# EAGLE design Base Board (EAGLE 7.2.0)
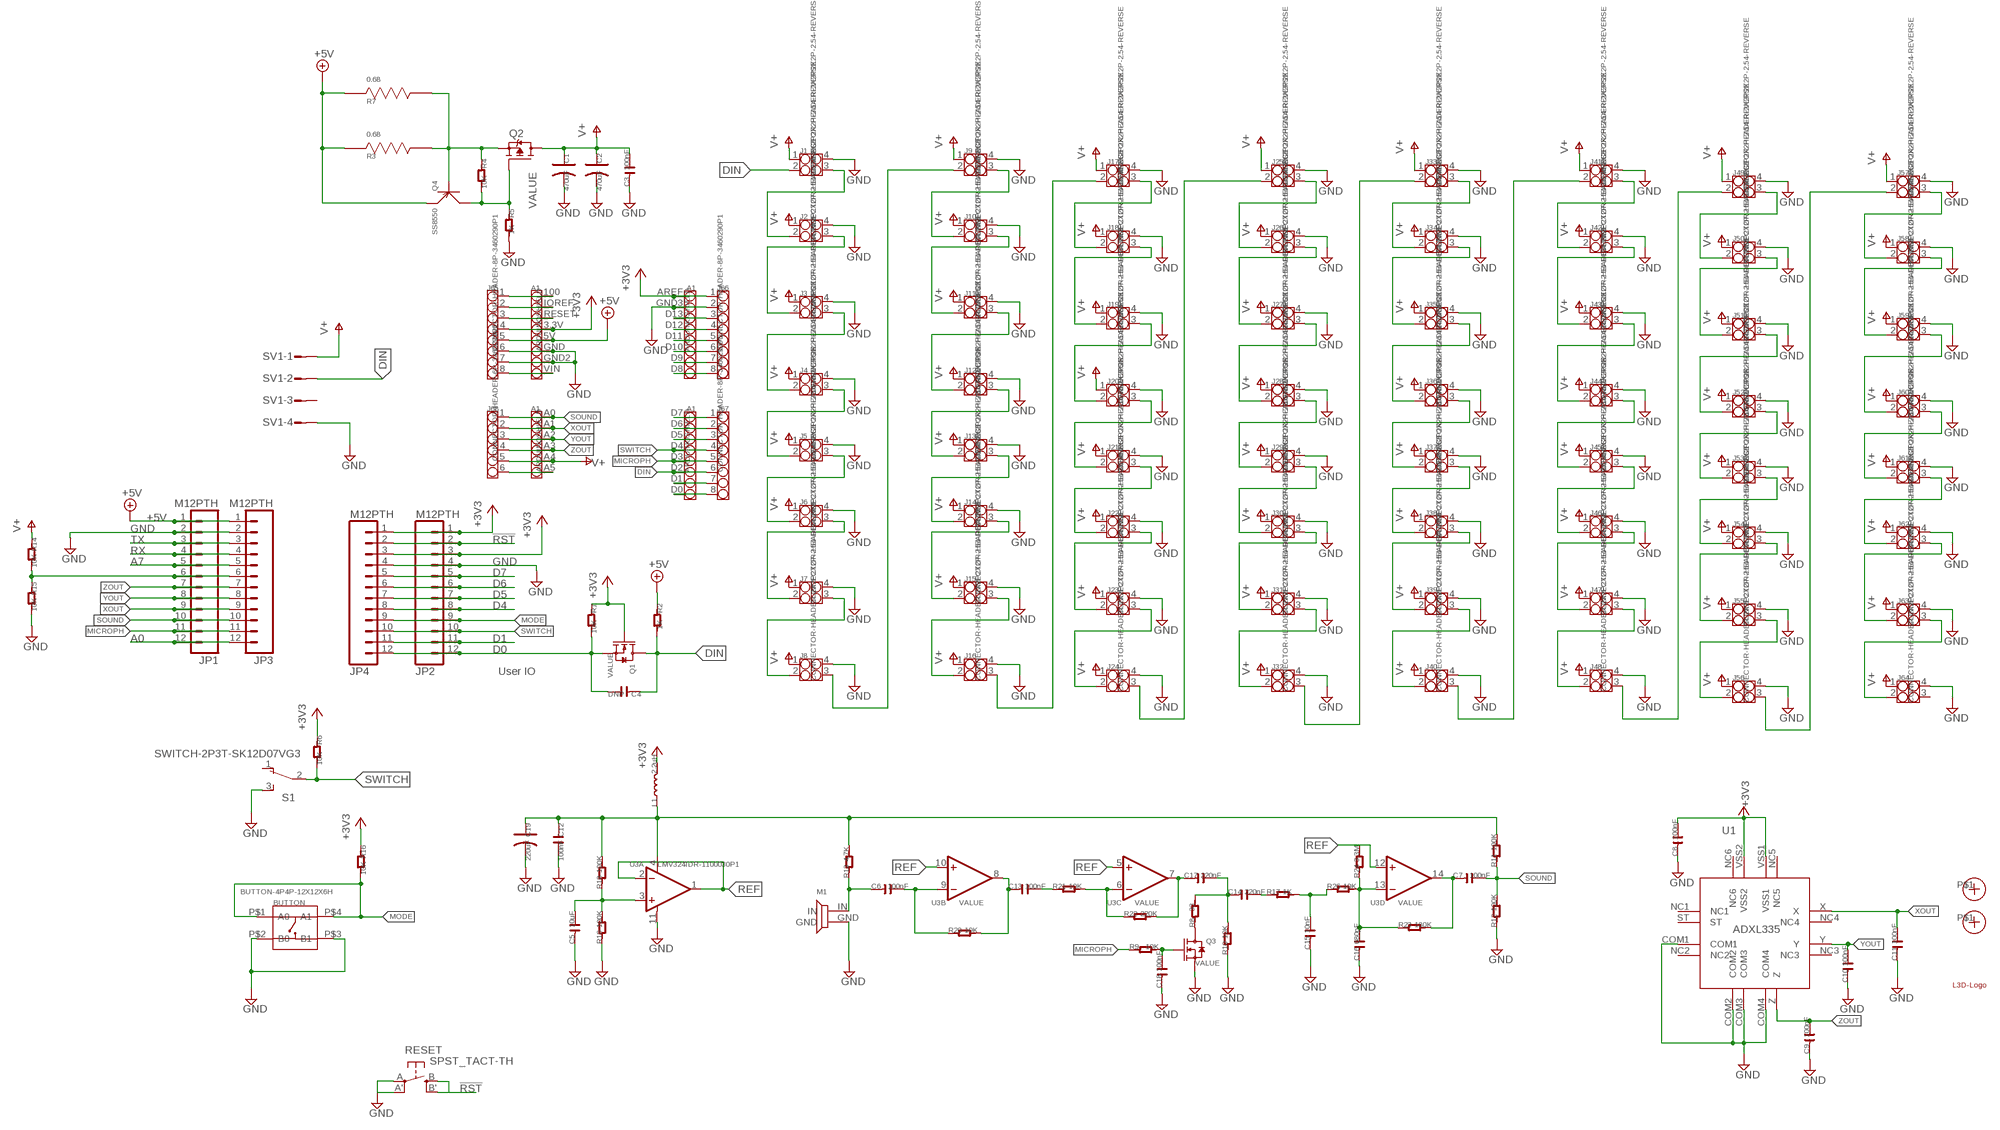
[diagram p0: schematic, sheet 1]

## Parts
A1  ARDUINOSHIELD  [ARDUINOSHIELD]
BUTTON  BUTTON-4P4P-12X12X6H  [4P-12X12X6H]
C1  470uF  C-POLAR  [CAPACITOR-E3-8]
C2  470uF  C-POLAR  [CAPACITOR-E3-8]
C3  100nF  C-0603  [C0603]
C4  DNP  C-0603  [C0603]
C5  10uF  C-0603  [C0603]
C6  100nF  C-0603  [C0603]
C7  100nF  C-0603  [C0603]
C8  100nF  C-0603  [C0603]
C9  100nF  C-0603  [C0603]
C10  100nF  C-0603  [C0603]
C11  100nF  C-0603  [C0603]
C12  100nF  C-0603  [C0603]
C13  100nF  C-0603  [C0603]
C14  220nF  C-0603  [C0603]
C15  10nF  C-0603  [C0603]
C16  680pF  C-0603  [C0603]
C17  220nF  C-0603  [C0603]
C18  100nF  C-0603  [C0603]
C19  220uF  C-POLAR-B  [AVX-B]
J1  CONNECTOR-HEADER-2X2P2X2P-2.54-REVERSE  [2X2P-2.54-REVERSE]
J2  CONNECTOR-HEADER-2X2P2X2P-2.54-REVERSE  [2X2P-2.54-REVERSE]
J3  CONNECTOR-HEADER-2X2P2X2P-2.54-REVERSE  [2X2P-2.54-REVERSE]
J4  CONNECTOR-HEADER-2X2P2X2P-2.54-REVERSE  [2X2P-2.54-REVERSE]
J5  CONNECTOR-HEADER-2X2P2X2P-2.54-REVERSE  [2X2P-2.54-REVERSE]
J6  CONNECTOR-HEADER-2X2P2X2P-2.54-REVERSE  [2X2P-2.54-REVERSE]
J7  CONNECTOR-HEADER-2X2P2X2P-2.54-REVERSE  [2X2P-2.54-REVERSE]
J8  CONNECTOR-HEADER-2X2P2X2P-2.54-REVERSE  [2X2P-2.54-REVERSE]
J9  CONNECTOR-HEADER-2X2P2X2P-2.54-REVERSE  [2X2P-2.54-REVERSE]
J10  CONNECTOR-HEADER-2X2P2X2P-2.54-REVERSE  [2X2P-2.54-REVERSE]
J11  CONNECTOR-HEADER-2X2P2X2P-2.54-REVERSE  [2X2P-2.54-REVERSE]
J12  CONNECTOR-HEADER-2X2P2X2P-2.54-REVERSE  [2X2P-2.54-REVERSE]
J13  CONNECTOR-HEADER-2X2P2X2P-2.54-REVERSE  [2X2P-2.54-REVERSE]
J14  CONNECTOR-HEADER-2X2P2X2P-2.54-REVERSE  [2X2P-2.54-REVERSE]
J15  CONNECTOR-HEADER-2X2P2X2P-2.54-REVERSE  [2X2P-2.54-REVERSE]
J16  CONNECTOR-HEADER-2X2P2X2P-2.54-REVERSE  [2X2P-2.54-REVERSE]
J17  CONNECTOR-HEADER-2X2P2X2P-2.54-REVERSE  [2X2P-2.54-REVERSE]
J18  CONNECTOR-HEADER-2X2P2X2P-2.54-REVERSE  [2X2P-2.54-REVERSE]
J19  CONNECTOR-HEADER-2X2P2X2P-2.54-REVERSE  [2X2P-2.54-REVERSE]
J20  CONNECTOR-HEADER-2X2P2X2P-2.54-REVERSE  [2X2P-2.54-REVERSE]
J21  CONNECTOR-HEADER-2X2P2X2P-2.54-REVERSE  [2X2P-2.54-REVERSE]
J22  CONNECTOR-HEADER-2X2P2X2P-2.54-REVERSE  [2X2P-2.54-REVERSE]
J23  CONNECTOR-HEADER-2X2P2X2P-2.54-REVERSE  [2X2P-2.54-REVERSE]
J24  CONNECTOR-HEADER-2X2P2X2P-2.54-REVERSE  [2X2P-2.54-REVERSE]
J25  CONNECTOR-HEADER-2X2P2X2P-2.54-REVERSE  [2X2P-2.54-REVERSE]
J26  CONNECTOR-HEADER-2X2P2X2P-2.54-REVERSE  [2X2P-2.54-REVERSE]
J27  CONNECTOR-HEADER-2X2P2X2P-2.54-REVERSE  [2X2P-2.54-REVERSE]
J28  CONNECTOR-HEADER-2X2P2X2P-2.54-REVERSE  [2X2P-2.54-REVERSE]
J29  CONNECTOR-HEADER-2X2P2X2P-2.54-REVERSE  [2X2P-2.54-REVERSE]
J30  CONNECTOR-HEADER-2X2P2X2P-2.54-REVERSE  [2X2P-2.54-REVERSE]
J31  CONNECTOR-HEADER-2X2P2X2P-2.54-REVERSE  [2X2P-2.54-REVERSE]
J32  CONNECTOR-HEADER-2X2P2X2P-2.54-REVERSE  [2X2P-2.54-REVERSE]
J33  CONNECTOR-HEADER-2X2P2X2P-2.54-REVERSE  [2X2P-2.54-REVERSE]
J34  CONNECTOR-HEADER-2X2P2X2P-2.54-REVERSE  [2X2P-2.54-REVERSE]
J35  CONNECTOR-HEADER-2X2P2X2P-2.54-REVERSE  [2X2P-2.54-REVERSE]
J36  CONNECTOR-HEADER-2X2P2X2P-2.54-REVERSE  [2X2P-2.54-REVERSE]
J37  CONNECTOR-HEADER-2X2P2X2P-2.54-REVERSE  [2X2P-2.54-REVERSE]
J38  CONNECTOR-HEADER-2X2P2X2P-2.54-REVERSE  [2X2P-2.54-REVERSE]
J39  CONNECTOR-HEADER-2X2P2X2P-2.54-REVERSE  [2X2P-2.54-REVERSE]
J40  CONNECTOR-HEADER-2X2P2X2P-2.54-REVERSE  [2X2P-2.54-REVERSE]
J41  CONNECTOR-HEADER-2X2P2X2P-2.54-REVERSE  [2X2P-2.54-REVERSE]
J42  CONNECTOR-HEADER-2X2P2X2P-2.54-REVERSE  [2X2P-2.54-REVERSE]
J43  CONNECTOR-HEADER-2X2P2X2P-2.54-REVERSE  [2X2P-2.54-REVERSE]
J44  CONNECTOR-HEADER-2X2P2X2P-2.54-REVERSE  [2X2P-2.54-REVERSE]
J45  CONNECTOR-HEADER-2X2P2X2P-2.54-REVERSE  [2X2P-2.54-REVERSE]
J46  CONNECTOR-HEADER-2X2P2X2P-2.54-REVERSE  [2X2P-2.54-REVERSE]
J47  CONNECTOR-HEADER-2X2P2X2P-2.54-REVERSE  [2X2P-2.54-REVERSE]
J48  CONNECTOR-HEADER-2X2P2X2P-2.54-REVERSE  [2X2P-2.54-REVERSE]
J49  CONNECTOR-HEADER-2X2P2X2P-2.54-REVERSE  [2X2P-2.54-REVERSE]
J50  CONNECTOR-HEADER-2X2P2X2P-2.54-REVERSE  [2X2P-2.54-REVERSE]
J51  CONNECTOR-HEADER-2X2P2X2P-2.54-REVERSE  [2X2P-2.54-REVERSE]
J52  CONNECTOR-HEADER-2X2P2X2P-2.54-REVERSE  [2X2P-2.54-REVERSE]
J53  CONNECTOR-HEADER-2X2P2X2P-2.54-REVERSE  [2X2P-2.54-REVERSE]
J54  CONNECTOR-HEADER-2X2P2X2P-2.54-REVERSE  [2X2P-2.54-REVERSE]
J55  CONNECTOR-HEADER-2X2P2X2P-2.54-REVERSE  [2X2P-2.54-REVERSE]
J56  CONNECTOR-HEADER-2X2P2X2P-2.54-REVERSE  [2X2P-2.54-REVERSE]
J57  CONNECTOR-HEADER-2X2P2X2P-2.54-REVERSE  [2X2P-2.54-REVERSE]
J58  CONNECTOR-HEADER-2X2P2X2P-2.54-REVERSE  [2X2P-2.54-REVERSE]
J59  CONNECTOR-HEADER-2X2P2X2P-2.54-REVERSE  [2X2P-2.54-REVERSE]
J60  CONNECTOR-HEADER-2X2P2X2P-2.54-REVERSE  [2X2P-2.54-REVERSE]
J61  CONNECTOR-HEADER-2X2P2X2P-2.54-REVERSE  [2X2P-2.54-REVERSE]
J62  CONNECTOR-HEADER-2X2P2X2P-2.54-REVERSE  [2X2P-2.54-REVERSE]
J63  CONNECTOR-HEADER-2X2P2X2P-2.54-REVERSE  [2X2P-2.54-REVERSE]
J64  CONNECTOR-HEADER-2X2P2X2P-2.54-REVERSE  [2X2P-2.54-REVERSE]
J65  CONNECTOR-HEADER-8P-3460290P1  [1X8P-2.54-8.5-BLACK-FEMALE]
J66  CONNECTOR-HEADER-8P-3460290P1  [1X8P-2.54-8.5-BLACK-FEMALE]
J67  CONNECTOR-HEADER-8P-3460290P1  [1X8P-2.54-8.5-BLACK-FEMALE]
J68  CONNECTOR-HEADER-6P-3460270P1  [1X6P-2.54-8.5-BLACK-FEMALE]
JP1  M12PTH  [1X12-SMALL-PADS]
JP2  M12PTH  [1X12-SMALL-PADS]
JP3  M12PTH  [1X12-SMALL-PADS]
JP4  M12PTH  [1X12-SMALL-PADS]
L1  2.2uH  L-0603  [L0603]
M1  MICROPHONE  [MICROPHONE]
Q1  2N7002  MOSFET-N-044020001  [SOT23]
Q2  FDD6637  FDD4141TO252  [TO252]
Q3  2N7002  MOSFET-N-044020001  [SOT23]
Q4  SS8550  TRANSISTOR-PNP-041003001  [SOT23]
R1  10K  R-0603  [R0603]
R2  1K  R-0603  [R0603]
R3  0.68  RESISTOR-3W-20MM  [RESISTOR-3W-20MM]
R4  10K  R-0603  [R0603]
R5  1K  R-0603  [R0603]
R6  10K  R-0603  [R0603]
R7  0.68  RESISTOR-3W-20MM  [RESISTOR-3W-20MM]
R8  33  R-0603  [R0603]
R9  10K  R-0603  [R0603]
R10  10K  R-0603  [R0603]
R11  100K  R-0603  [R0603]
R12  100K  R-0603  [R0603]
R13  4.7K  R-0603  [R0603]
R14  10K  R-0603  [R0603]
R15  10K  R-0603  [R0603]
R16  10K  R-0603  [R0603]
R17  1K  R-0603  [R0603]
R18  100K  R-0603  [R0603]
R19  100K  R-0603  [R0603]
R20  10K  R-0603  [R0603]
R21  10K  R-0603  [R0603]
R22  220K  R-0603  [R0603]
R23  180K  R-0603  [R0603]
R24  3.3M  R-0603  [R0603]
R26  10K  R-0603  [R0603]
RESET  SPST_TACT-TH  [EVQ-Q2-TH]
S1  SWITCH-2P3T-SK12D07VG3  [SWITCH-2P3T-SK12D07VG3]
SV1  CON-S04P  [S04P]
U1  ADXL335  [ADXL335]
U3  LMV324IDR-1100030P1  [SOIC14]
U$1  L3D-LOGOL3DCUBE-LOGO-0.8X2.5  [L3DCUBE-LOGO-0.8X2.5]
U$2  FIDUCIAL-MARK  [FIDUCIAL-MARK]
U$3  FIDUCIAL-MARK  [FIDUCIAL-MARK]

## Nets
!RST: JP2.2 JP4.2 RESET.B'(S1) RESET.B(S)
+3V3: A1.3.3V A1.AREF C8.2 J65.4 J66.1 JP2.1 JP2.3 JP4.1 JP4.3 L1.2 Q1.1(G) R1.1 R6.1 R16.1 U1.VSS1 U1.VSS2
+5V: A1.5V J65.5 JP1.1 JP3.1 Q4.2(E) R2.1 R3.1 R7.1
A0: JP1.12 JP3.12
A7: JP1.5 JP3.5
D0: C4.2 JP2.12 JP4.12 Q1.2(S) R1.2
D1: JP2.11 JP4.11
D4: JP2.8 JP4.8
D5: JP2.7 JP4.7
D6: JP2.6 JP4.6
D7: JP2.5 JP4.5
DIN: A1.D2 C4.1 J1.2 J67.6 Q1.3(D) R2.2 SV1.2 SV1.P$2
GND [vcc]: A1.GND A1.GND2 A1.GND3 BUTTON.P$2(B0) BUTTON.P$3(B1) C1.- C2.- C3.1 C5.1 C8.1 C9.1 C10.1 C11.1 C12.2 C15.1 C16.1 C18.1 C19.- J1.4 J2.4 J3.4 J4.4 J5.4 J6.4 J7.4 J8.4 J9.4 J10.4 J11.4 J12.4 J13.4 J14.4 J15.4 J16.4 J17.4 J18.4 J19.4 J20.4 J21.4 J22.4 J23.4 J24.4 J25.4 J26.4 J27.4 J28.4 J29.4 J30.4 J31.4 J32.4 J33.4 J34.4 J35.4 J36.4 J37.4 J38.4 J39.4 J40.4 J41.4 J42.4 J43.4 J44.4 J45.4 J46.4 J47.4 J48.4 J49.4 J50.4 J51.4 J52.4 J53.4 J54.4 J55.4 J56.4 J57.4 J58.4 J59.4 J60.4 J61.4 J62.4 J63.4 J64.4 J65.6 J65.7 J66.2 JP1.2 JP2.4 JP3.2 JP4.4 M1.GND Q3.2(S) R5.2 R10.1 R12.1 R15.2 R19.1 RESET.A'(P1) RESET.A(P) S1.3(S) SV1.4 SV1.P$4 U1.COM1 U1.COM2 U1.COM3 U1.COM4 U3.11(A:V-)
MICROPH: A1.D3 J67.5 JP1.11 JP3.11 R9.1
MODE: BUTTON.P$1(A0) BUTTON.P$4(A1) JP2.9 JP4.9 R16.2
N$1: J1.3 J2.2
N$2: J2.3 J3.2
N$3: J3.3 J4.2
N$4: J5.3 J6.2
N$5: J6.3 J7.2
N$6: J7.3 J8.2
N$7: J4.3 J5.2
N$8: J9.3 J10.2
N$9: J10.3 J11.2
N$10: J11.3 J12.2
N$11: J13.3 J14.2
N$12: J14.3 J15.2
N$13: J15.3 J16.2
N$14: J12.3 J13.2
N$15: J17.3 J18.2
N$16: J18.3 J19.2
N$17: J19.3 J20.2
N$18: J21.3 J22.2
N$19: J22.3 J23.2
N$20: J23.3 J24.2
N$21: J20.3 J21.2
N$22: J25.3 J26.2
N$23: J26.3 J27.2
N$24: J27.3 J28.2
N$25: J29.3 J30.2
N$26: J30.3 J31.2
N$27: J31.3 J32.2
N$28: J28.3 J29.2
N$29: J8.3 J9.2
N$30: J16.3 J17.2
N$31: J24.3 J25.2
N$32: C18.2 Q3.1(G) R9.2
N$33: J33.3 J34.2
N$34: J34.3 J35.2
N$35: J35.3 J36.2
N$36: J37.3 J38.2
N$37: J38.3 J39.2
N$38: J39.3 J40.2
N$39: J36.3 J37.2
N$40: J41.3 J42.2
N$41: J42.3 J43.2
N$42: J43.3 J44.2
N$43: J45.3 J46.2
N$44: J46.3 J47.2
N$45: J47.3 J48.2
N$46: J44.3 J45.2
N$47: J49.3 J50.2
N$48: J50.3 J51.2
N$49: J51.3 J52.2
N$50: J53.3 J54.2
N$51: J54.3 J55.2
N$52: J55.3 J56.2
N$53: J52.3 J53.2
N$54: J57.3 J58.2
N$55: J58.3 J59.2
N$56: J59.3 J60.2
N$57: J61.3 J62.2
N$58: J62.3 J63.2
N$59: J63.3 J64.2
N$60: J60.3 J61.2
N$61: J40.3 J41.2
N$62: J48.3 J49.2
N$63: J56.3 J57.2
N$64: J32.3 J33.2
N$65: Q2.2(S) Q4.1(B) R3.2 R4.1 R7.2
N$66: Q3.3(D) R8.1
N$67: Q2.1(G) Q4.3(C) R4.2 R5.1
N$68: C14.2 R17.1
N$69: C15.2 R17.2 R26.1
N$70: C16.2 R23.1 R24.1 R26.2 U3.13(D:IN-)
N$71: JP1.6 JP3.6 R14.2 R15.1
N$72: C6.1 M1.IN R13.1
N$73: A1.100 J65.1
N$74: A1.IOREF J65.2
N$82: A1.RESET J65.3
N$83: A1.VIN J65.8
N$84: A1.A5 J68.6
N$85: A1.D13 J66.3
N$86: A1.D12 J66.4
N$87: A1.D11 J66.5
N$88: A1.D10 J66.6
N$89: A1.D9 J66.7
N$90: A1.D8 J66.8
N$91: A1.D7 J67.1
N$92: A1.D6 J67.2
N$93: A1.D5 J67.3
N$94: A1.D1 J67.7
N$95: A1.D0 J67.8
N$96: C5.2 R18.1 R19.2 U3.3(A:IN+)
N$97: C6.2 R20.1 U3.9(B:IN-)
N$98: C13.1 R20.2 U3.8(B:OUT)
N$99: C13.2 R21.1
N$100: R21.2 R22.1 U3.6(C:IN-)
N$101: C14.1 C17.2 R8.2 R10.2
N$102: C12.1 C19.+ L1.1 R11.2 R13.2 R18.2 U3.4(A:V+)
N$104: C7.1 R23.2 U3.14(D:OUT)
N$106: C17.1 R22.2 U3.7(C:OUT)
REF: R24.2 U3.1(A:OUT) U3.2(A:IN-) U3.5(C:IN+) U3.10(B:IN+) U3.12(D:IN+)
RX: JP1.4 JP3.4
SOUND: A1.A0 C7.2 J68.1 JP1.10 JP3.10 R11.1 R12.2
SWITCH: A1.D4 J67.4 JP2.10 JP4.10 R6.2 S1.2(P)
TX: JP1.3 JP3.3
V+: A1.A4 C1.+ C2.+ C3.2 J1.1 J2.1 J3.1 J4.1 J5.1 J6.1 J7.1 J8.1 J9.1 J10.1 J11.1 J12.1 J13.1 J14.1 J15.1 J16.1 J17.1 J18.1 J19.1 J20.1 J21.1 J22.1 J23.1 J24.1 J25.1 J26.1 J27.1 J28.1 J29.1 J30.1 J31.1 J32.1 J33.1 J34.1 J35.1 J36.1 J37.1 J38.1 J39.1 J40.1 J41.1 J42.1 J43.1 J44.1 J45.1 J46.1 J47.1 J48.1 J49.1 J50.1 J51.1 J52.1 J53.1 J54.1 J55.1 J56.1 J57.1 J58.1 J59.1 J60.1 J61.1 J62.1 J63.1 J64.1 J68.5 Q2.3(D) R14.1 SV1.1 SV1.P$1
XOUT: A1.A1 C11.2 J68.2 JP1.9 JP3.9 U1.X
YOUT: A1.A2 C10.2 J68.3 JP1.8 JP3.8 U1.Y
ZOUT: A1.A3 C9.2 J68.4 JP1.7 JP3.7 U1.Z
Unconnected: J64.3 S1.1(O) SV1.3 SV1.P$3 U1.NC1 U1.NC2 U1.NC3 U1.NC4 U1.NC5 U1.NC6 U1.ST U$2.P$1 U$3.P$1

## Notes on the sheet
- User IO

## Library data of the parts
A1 = OPL Eagle Library:ARDUINOSHIELD
BUTTON = OPL Eagle Library:BUTTON-4P
C1 C2 C19 = OPL Eagle Library:C-POLAR*
C3-C18 = OPL Eagle Library:C*
J1-J64 = OPL Eagle Library:CONNECTOR-HEADER-2X2P
J65-J67 = OPL Eagle Library:CONNECTOR-HEADER-8P
J68 = OPL Eagle Library:CONNECTOR-HEADER-6P
JP1-JP4 = Spark:M12: Header 12 Standard 12-pin 0.1" header. Use with straight break away headers (SKU : PRT-00116), right angle break away headers (PRT-00553), swiss pins (PRT-00743), machine pins (PRT-00117), and female headers (PRT-00115).
L1 = OPL Eagle Library:L*
M1 = OPL Eagle Library:MICROPHONE
Q1 Q3 = OPL Eagle Library:MOSFET-N: CJ2302：SMD MOSFET N-CH 20V-2.1A
Q2 = transistor-fet:FDD4141: P-Channel PowerTrench® MOSFET Source: FDD4141.pdf
Q4 = OPL Eagle Library:TRANSISTOR-PNP*: S8550：PNP Transistor
R1 R2 R4-R6 R8-R24 R26 = OPL Eagle Library:R*
R3 R7 = OPL Eagle Library:RESISTOR-3W-20MM
RESET = adafruit:SPST_TACT: SMT 6mm switch, EVQQ2 series http://www.ladyada.net/library/eagle
S1 = OPL Eagle Library:SWITCH-2P3T-SK12D07VG3: TINY SWITCH ON - ON Source: http://www2.produktinfo.conrad.com/datenblaetter/700000-724999/705152-da-01-de-Subminiaturschalter_TL_36YO.pdf
SV1 = OPL Eagle Library:CON-S04P: AMP MT CONNECTOR; OC_FARNELL: unknown; OC_NEWARK: unknown
U1 = OPL Eagle Library:ADXL335
U3 = OPL Eagle Library:LMV324IDR: General purpose LOW Voltage, Rail-to-Rail Output Amplifiers http://www.fairchildsemi.com/ds/LM/LMV358.pdf
U$1 = OPL Eagle Library:L3D-LOGO
U$2 U$3 = OPL Eagle Library:FIDUCIAL-MARK

## Board
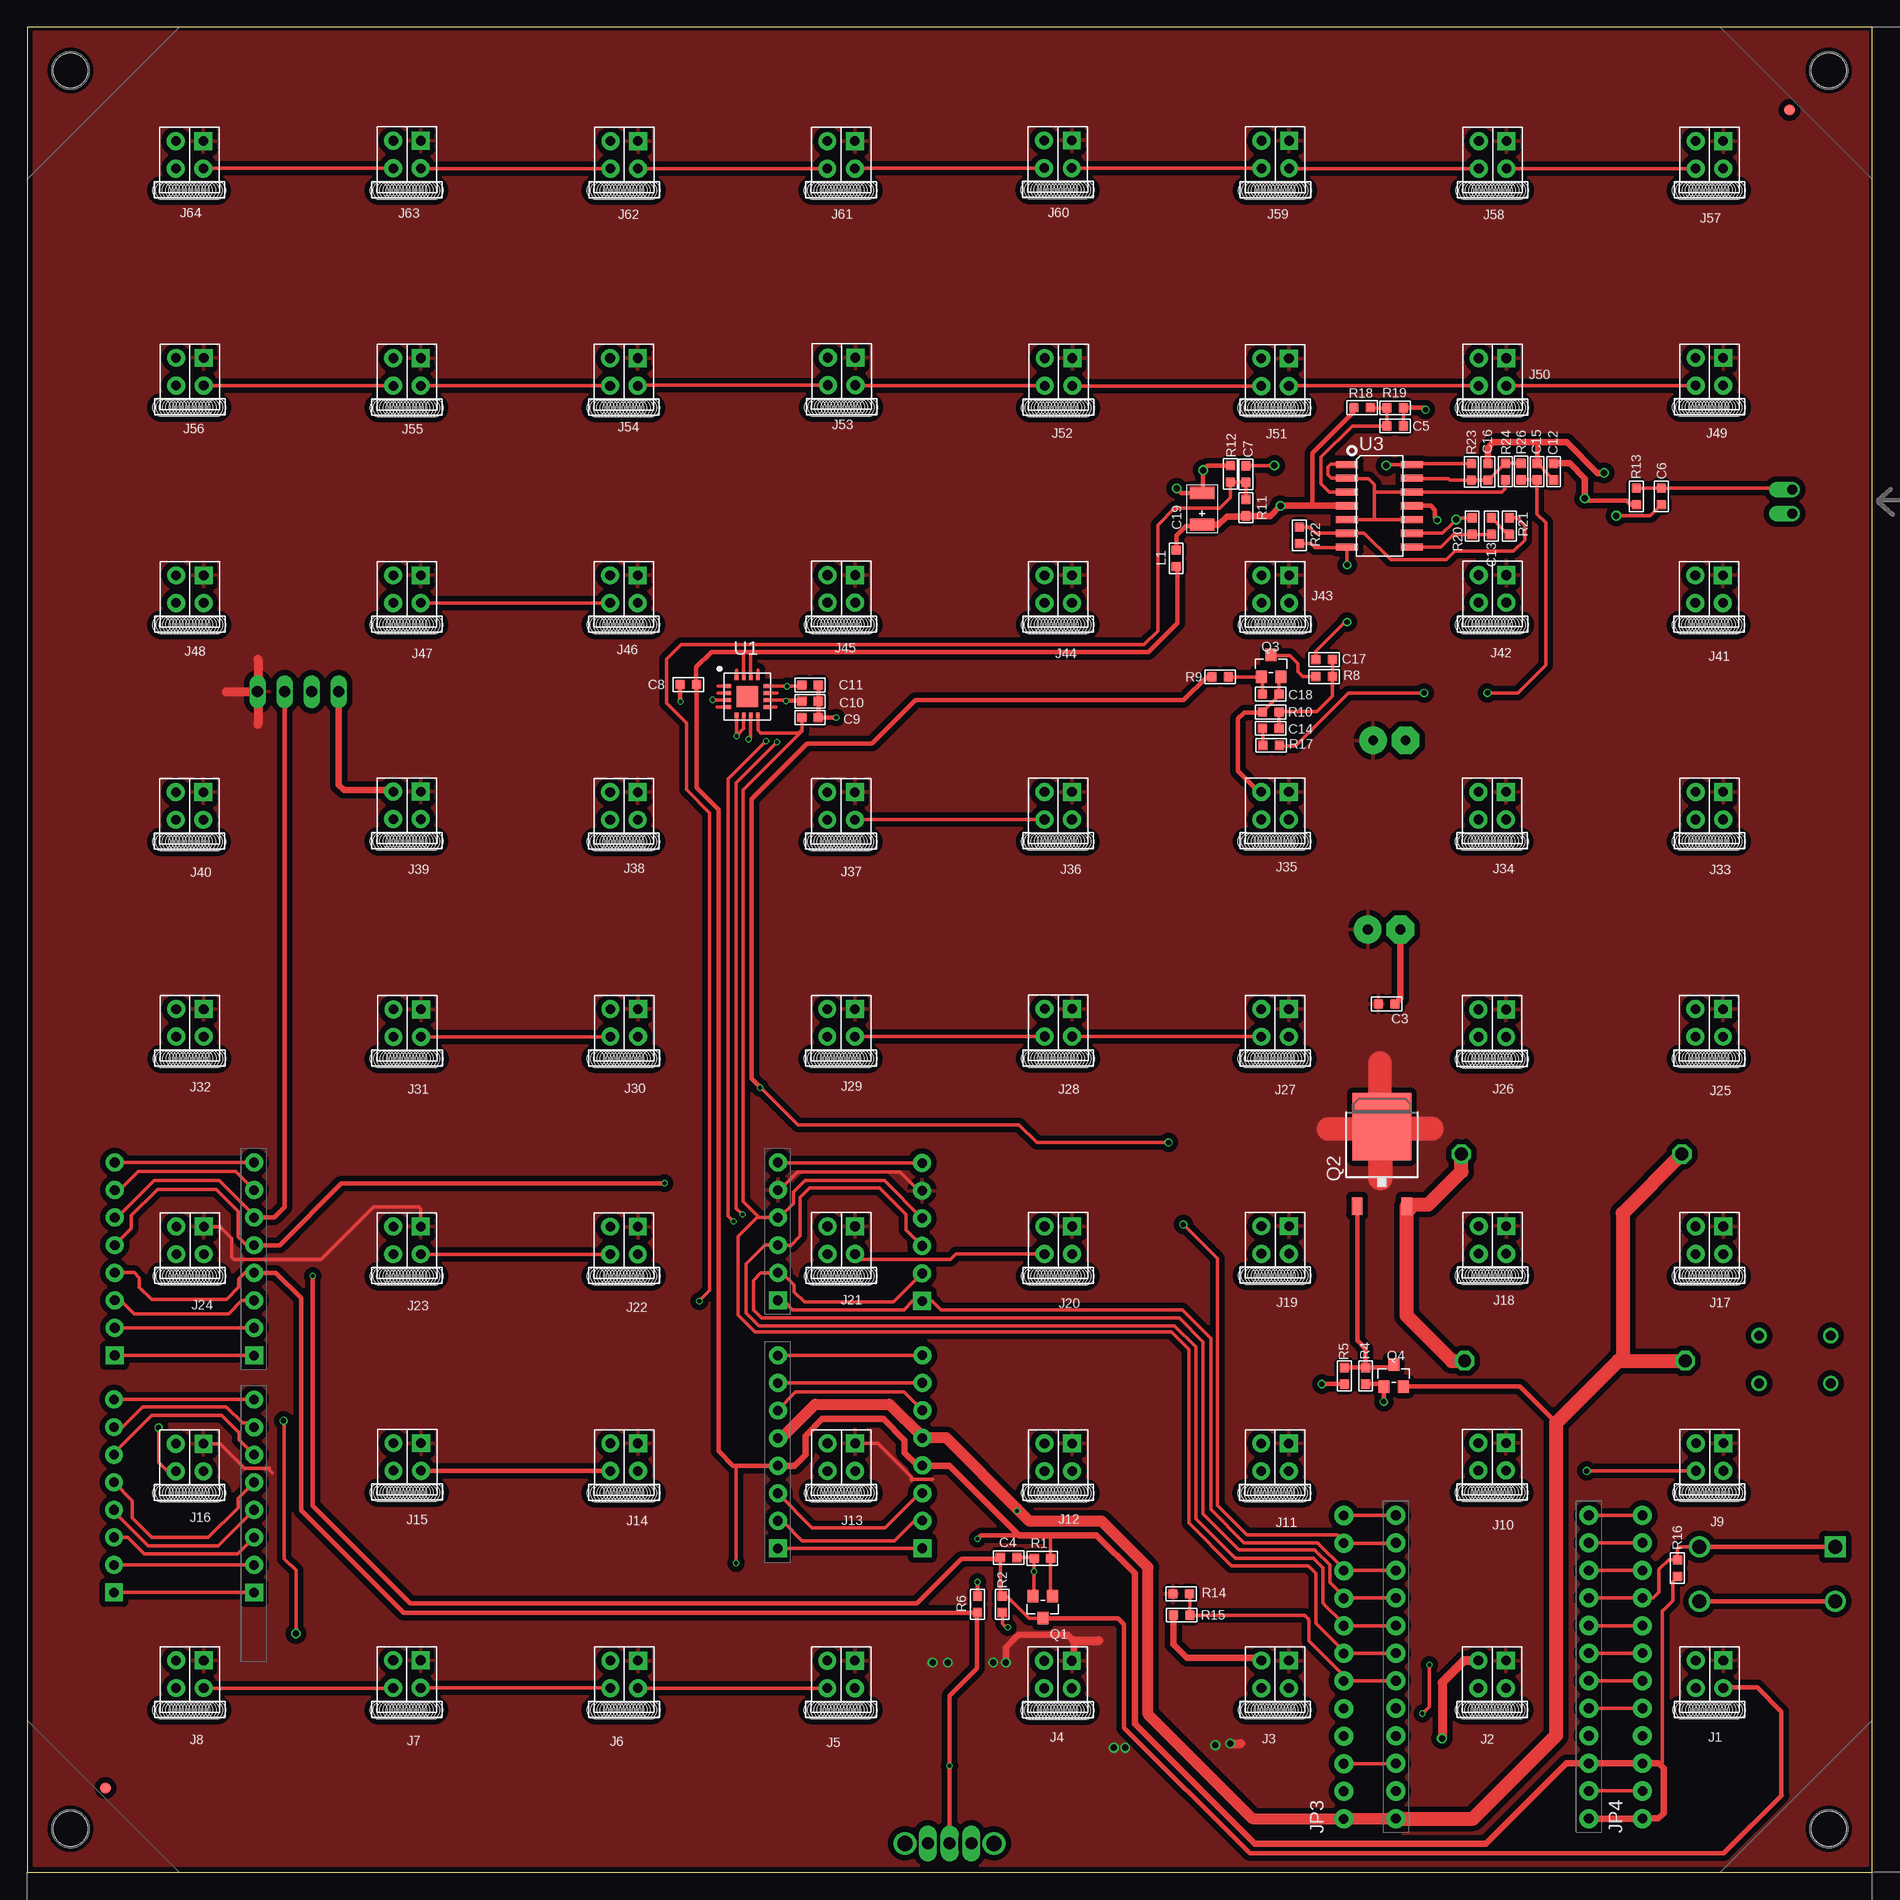
[diagram p1: board, top side]
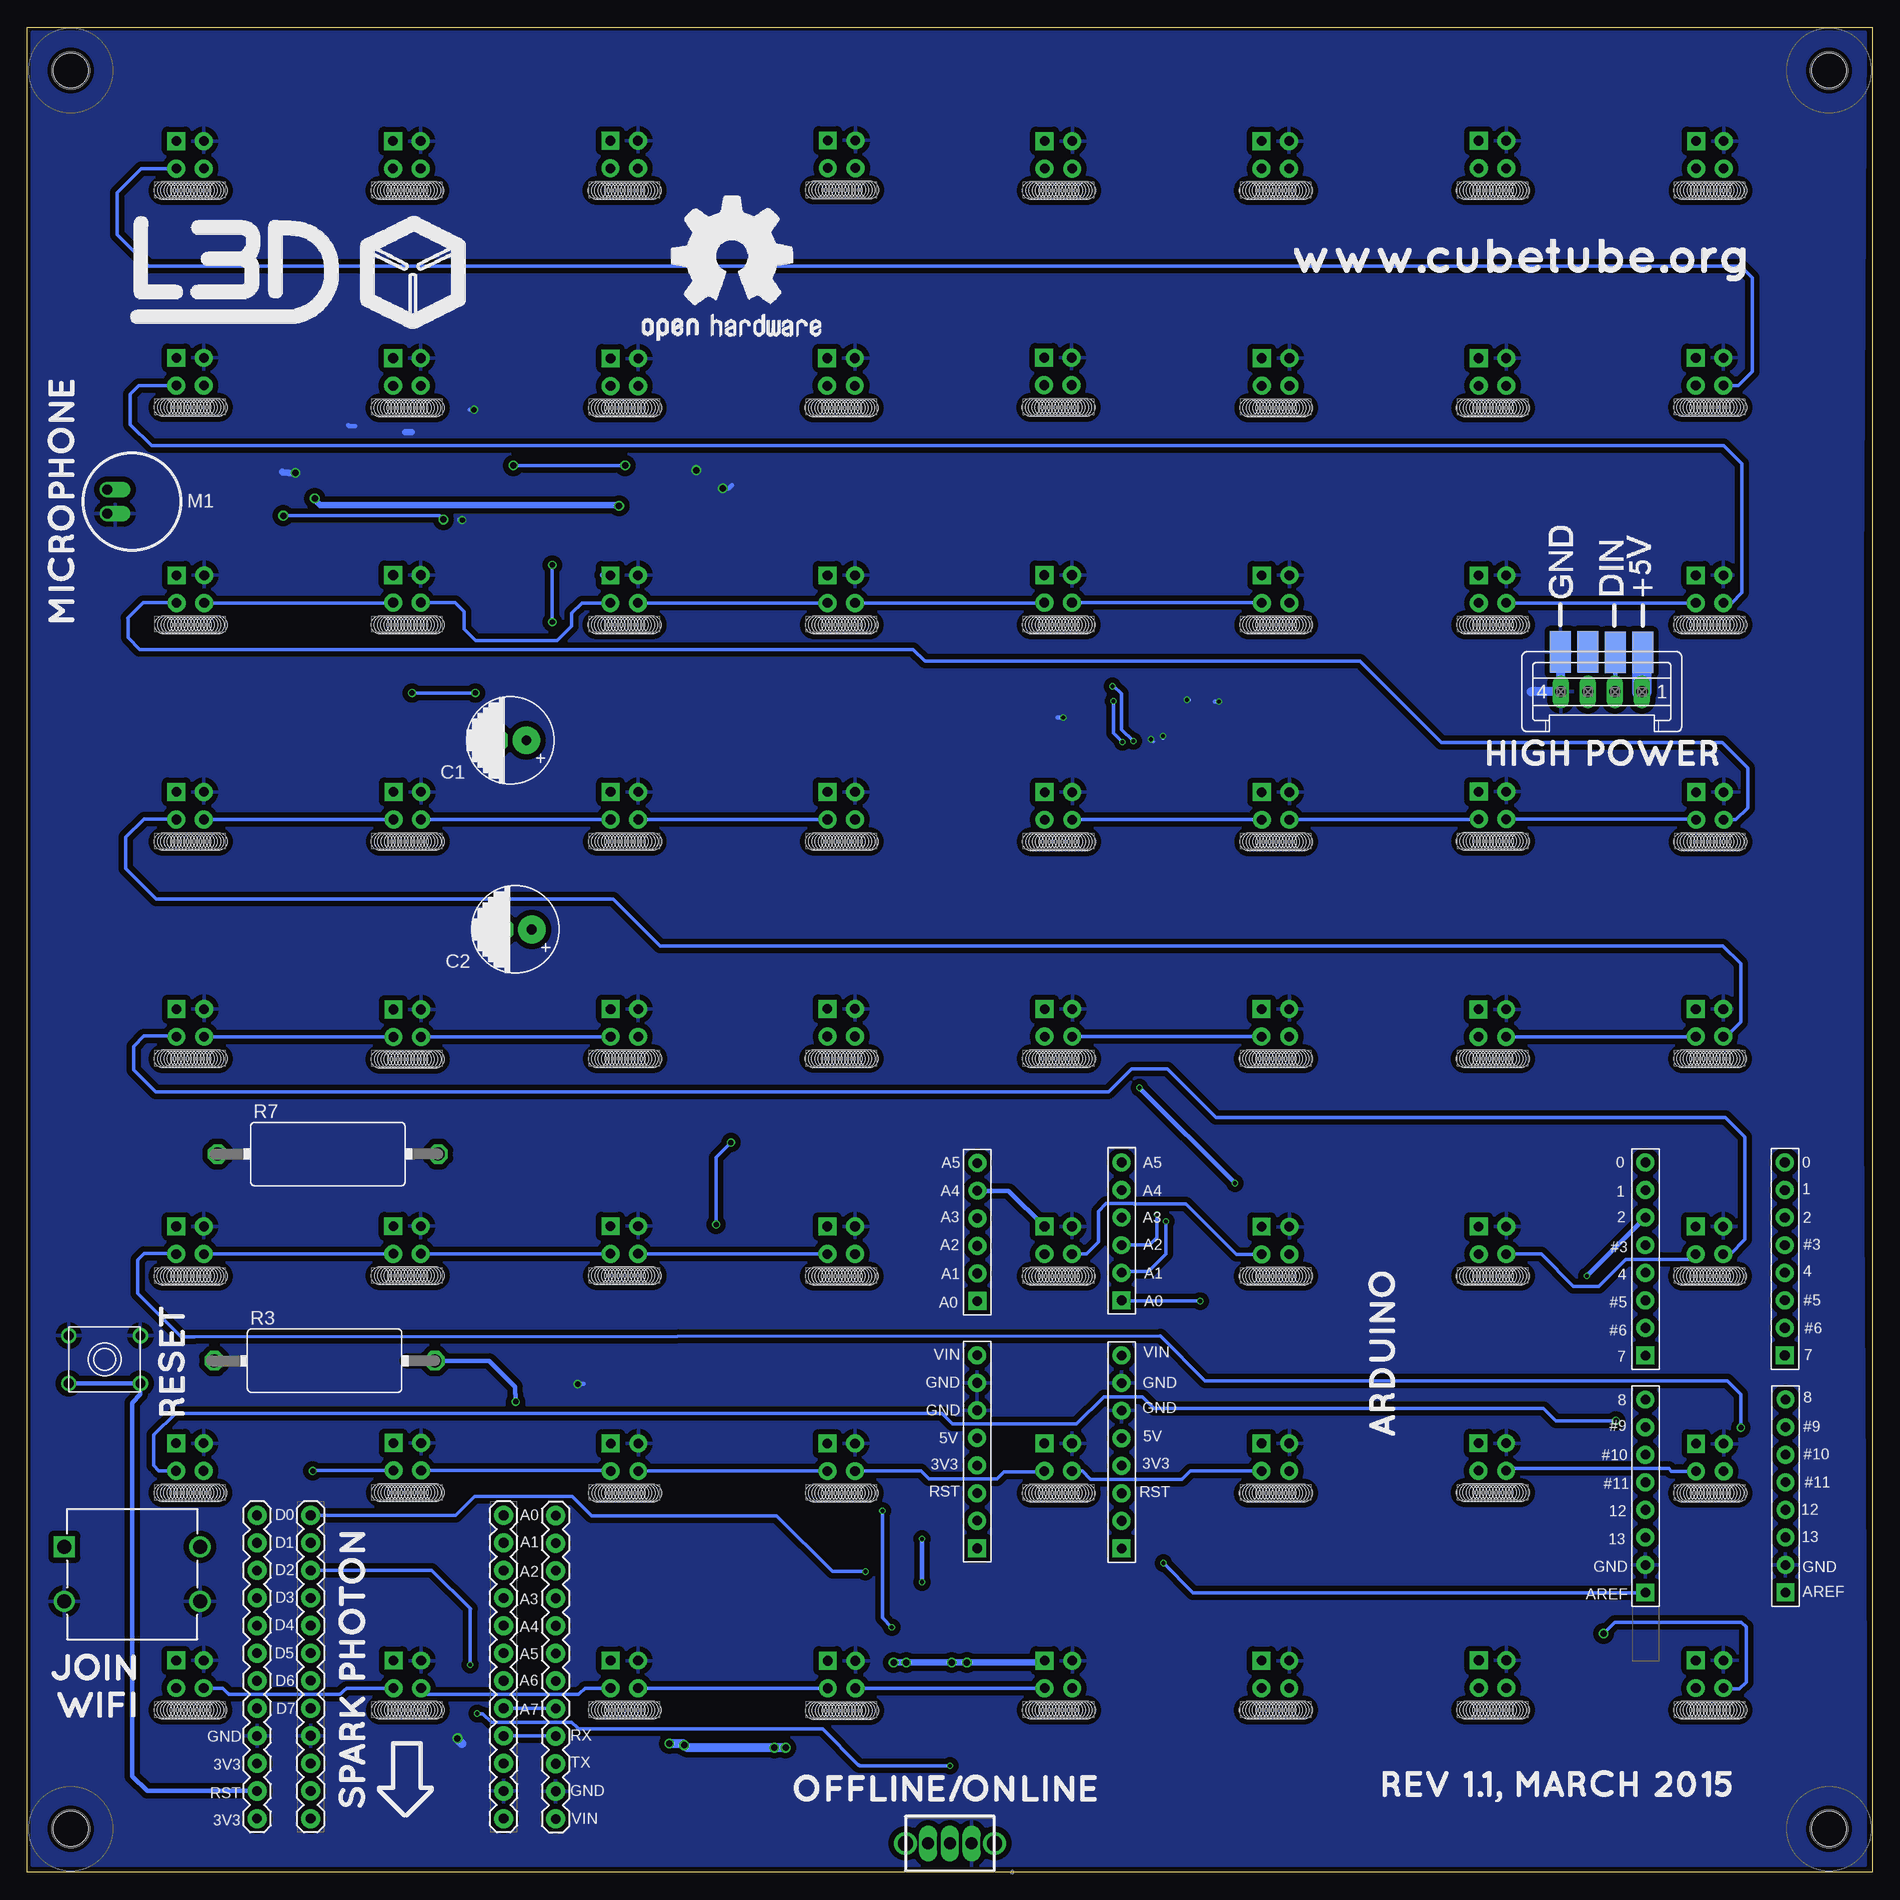
[diagram p2: board, bottom side, seen from below]

Size 170 x 170 mm. Coordinates in mm from the lower left corner, seen from the top.
Outline: 170,170 0,170 0,0 170,0 170,170
Copper layers (1*16): Top 0.035mm / dielectric 0.5mm / Bottom 0.035mm
Design rules "default *": minimum track width 10mil, minimum drill 15mil, track to track 8mil, track to pad 0mil, pad to pad 0mil, via to via 0mil, smd to smd 8mil, copper to edge 0mil, drill to drill 0mil, minimum pad ring 10mil, minimum via ring 0mil, stop-mask expansion 4mil, vias tented up to drill 0mil, thermal gap 20mil
Holes 3.2 mm at 3.99,166.01 165.99,166.01 165.99,4.01 3.99,4.01

### Footprints (pad centres in the part's own frame; a part is rotated, then mirrored left to right if it is on the bottom)
ARDUINOSHIELD = drill 0.889 pad 1.651: 3.3V 35.56,2.54; 5V 38.1,2.54; A1 53.34,2.54; A2 55.88,2.54; A3 58.42,2.54; A4 60.96,2.54; A5 63.5,2.54; D0 63.5,50.8; D1 60.96,50.8; D2 58.42,50.8; D3 55.88,50.8; D4 53.34,50.8; D5 50.8,50.8; D6 48.26,50.8; D8 41.656,50.8; D9 39.116,50.8; D10 36.576,50.8; D11 34.036,50.8; D12 31.496,50.8; D13 28.956,50.8; GND 40.64,2.54; GND2 43.18,2.54; GND3 26.416,50.8; IOREF 30.48,2.54; RESET 33.02,2.54; VIN 45.72,2.54 | drill 0.889 pad 1.651 square: 100 27.94,2.54; A0 50.8,2.54; AREF 23.876,50.8; D7 45.72,50.8
4P-12X12X6H = drill 1.3 square: P$1 -6.25,2.5 | drill 1.3: P$2 -6.25,-2.5; P$3 6.25,-2.5; P$4 6.25,2.5
CAPACITOR-E3-8 = drill 0.9 pad 2.54: + -1.5,0 | drill 0.9 pad 2.54 octagon: - 1.5,0
C0603 = smd 0.889 x 0.889: 1 -0.762,0; 2 0.762,0
AVX-B = smd 1.143 x 2.286: + -1.46,0; - 1.46,0
2X2P-2.54-REVERSE = drill 0.889 pad 1.651 square: 1 -1.27,-1.27 | drill 0.889 pad 1.651: 2 -1.27,1.27; 3 1.27,1.27; 4 1.27,-1.27 | hole 1.6: -2.2,3.3; -1.9,3.3; -1.6,3.3; -1.3,3.3; -1,3.3; -0.7,3.3; -0.4,3.3; -0.1,3.3; 0.2,3.3; 0.5,3.3; 0.8,3.3; 1.1,3.3; 1.4,3.3; 1.7,3.3; 2,3.3; 2.3,3.3; -2.5,3.3; 2.6,3.3
1X8P-2.54-8.5-BLACK-FEMALE = drill 0.889 pad 1.651 square: 1 0,8.89 | drill 0.889 pad 1.651: 2 0,6.35; 3 0,3.81; 4 0,1.27; 5 0,-1.27; 6 0,-3.81; 7 0,-6.35; 8 0,-8.89
1X6P-2.54-8.5-BLACK-FEMALE = drill 0.889 pad 1.651 square: 1 0,6.35 | drill 0.889 pad 1.651: 2 0,3.81; 3 0,1.27; 4 0,-1.27; 5 0,-3.81; 6 0,-6.35
1X12-SMALL-PADS = drill 0.889 pad 1.753: 1 0,0; 2 2.54,0; 3 5.08,0; 4 7.62,0; 5 10.16,0; 6 12.7,0; 7 15.24,0; 8 17.78,0; 9 20.32,0; 10 22.86,0; 11 25.4,0; 12 27.94,0
L0603 = smd 0.889 x 0.889: 1 -0.762,0; 2 0.762,0
MICROPHONE = drill 0.9 offset: GND 0,-1.1; IN 0,1.1
SOT23 = smd 1.016 x 1.143: 1 -0.889,-1.016; 2 0.889,-1.016; 3 0,1.016
TO252 = smd 1 x 1.6: 1 -2.28,-4.8; 2 2.28,-4.8 | smd 5.4 x 6.2: 3 0,2.5
R0603 = smd 0.889 x 0.889: 1 -0.762,0; 2 0.762,0
RESISTOR-3W-20MM = drill 1.194 octagon: 1 -10.16,0; 2 10.16,0
EVQ-Q2-TH = drill 0.9: A -3.3,-2.2; A' 3.3,-2.2; B -3.3,2.2; B' 3.3,2.2
SWITCH-2P3T-SK12D07VG3 = drill 1.1 pad 1.422 long: 1 -2,0; 2 0,0; 3 2,0 | drill 1.4 pad 1.93: M1 -4.1,0; M2 4.1,0
S04P = drill 1.016 long: 1 3.75,0; 2 1.25,0; 3 -1.25,0; 4 -3.75,0 | smd 1.93 x 3.81: P$1 3.81,3.632; P$2 1.27,3.632; P$3 -1.245,3.658; P$4 -3.759,3.658
ADXL335 = smd 0.5 x 0.35: COM1 -1.75,-0.325; NC1 -1.75,0.975; NC2 -1.75,-0.975; NC3 1.75,-0.975; NC4 1.75,0.325; ST -1.75,0.325; X 1.75,0.975; Y 1.75,-0.325 | smd 0.35 x 0.5: COM2 -0.975,-1.75; COM3 -0.325,-1.75; COM4 0.325,-1.75; NC5 0.975,1.75; NC6 -0.975,1.75; VSS1 0.325,1.75; VSS2 -0.325,1.75; Z 0.975,-1.75 | smd 1.95 x 1.95: P$17 0,0
SOIC14 = smd 2.032 x 0.66: 1 -2.997,3.81; 2 -2.997,2.54; 3 -2.997,1.27; 4 -2.997,0; 5 -2.997,-1.27; 6 -2.997,-2.54; 7 -2.997,-3.81; 8 2.997,-3.81; 9 2.997,-2.54; 10 2.997,-1.27; 11 2.997,0; 12 2.997,1.27; 13 2.997,2.54; 14 2.997,3.81
FIDUCIAL-MARK = smd 1 x 1: P$1 0,0

### Placement (x,y rotation side)
A1  71.71,1.9 90 top
BUTTON  160.32,27.48 0 bottom
C1  125.5,104.29 180 bottom
C2  125.02,86.87 180 bottom
C3  125.25,80.01 180 top
C4  90.42,29.01 0 top
C5  126.03,133.26 180 top
C6  150.57,126.78 270 top
C7  112.28,128.81 270 top
C8  60.91,109.42 0 top
C9  72.14,106.4 180 top
C10  72.14,107.9 180 top
C11  72.14,109.4 180 top
C12  140.63,129.06 270 top
C13  134.9,124.03 90 top
C14  114.58,105.41 180 top
C15  139.11,129.06 270 top
C16  134.57,129.03 270 top
C17  119.48,111.73 0 top
C18  114.58,108.56 180 top
C19  108.25,125.63 90 top
J1  155,18.25 180 top
J2  134.98,18.24 180 top
J3  114.98,18.24 180 top
J4  94.97,18.23 180 top
J5  74.99,18.24 180 top
J6  55,18.24 180 top
J7  34.99,18.26 180 top
J8  14.99,18.25 180 top
J9  155.01,38.26 180 top
J10  134.98,38.29 180 top
J11  114.96,38.24 180 top
J12  95,38.24 180 top
J13  75.01,38.25 180 top
J14  55,38.25 180 top
J15  35.01,38.27 180 top
J16  14.97,38.22 180 top
J17  154.99,58.24 180 top
J18  135,58.27 180 top
J19  114.99,58.27 180 top
J20  95,58.24 180 top
J21  75.01,58.24 180 top
J22  55,58.21 180 top
J23  35,58.23 180 top
J24  15.01,58.22 180 top
J25  154.97,78.26 180 top
J26  134.99,78.23 180 top
J27  114.97,78.26 180 top
J28  95.01,78.28 180 top
J29  74.99,78.27 180 top
J30  55,78.27 180 top
J31  35.01,78.24 180 top
J32  15,78.27 180 top
J33  154.99,98.27 180 top
J34  134.98,98.27 180 top
J35  114.98,98.27 180 top
J36  94.99,98.27 180 top
J37  74.99,98.25 180 top
J38  54.98,98.25 180 top
J39  35,98.3 180 top
J40  14.97,98.25 180 top
J41  154.96,118.23 180 top
J42  135.01,118.25 180 top
J43  115,118.23 180 top
J44  94.99,118.23 180 top
J45  75.01,118.25 180 top
J46  54.98,118.23 180 top
J47  35,118.23 180 top
J48  14.99,118.23 180 top
J49  154.99,138.26 180 top
J50  135.01,138.23 180 top
J51  114.98,138.21 180 top
J52  95.02,138.23 180 top
J53  75.04,138.29 180 top
J54  54.98,138.23 180 top
J55  35,138.23 180 top
J56  14.99,138.26 180 top
J57  154.99,158.24 180 top
J58  135.02,158.24 180 top
J59  115,158.27 180 top
J60  94.97,158.29 180 top
J61  74.99,158.24 180 top
J62  55.01,158.24 180 top
J63  35,158.27 180 top
J64  14.97,158.24 180 top
J65  82.47,38.75 180 bottom
J66  8,34.67 180 bottom
J67  8.06,56.52 180 bottom
J68  82.46,58.99 180 bottom
JP1  126.11,4.95 90 top
JP2  143.88,4.96 90 top
JP3  121.3,4.93 90 top
JP4  148.82,4.95 90 top
L1  105.87,121.06 270 top
M1  162.61,126.29 0 bottom
Q1  93.57,24.43 180 top
Q2  124.82,66.19 0 top
Q3  114.6,111.15 0 top
Q4  125.91,45.77 0 top
R1  93.54,28.94 180 top
R2  89.85,24.7 90 top
R3  142.6,47.14 0 bottom
R4  123.32,45.75 90 top
R5  121.36,45.75 270 top
R6  87.55,24.69 270 top
R7  142.3,66.17 0 bottom
R8  119.48,110.16 0 top
R9  109.92,110.14 0 top
R10  114.58,106.91 0 top
R11  112.28,125.74 270 top
R12  110.86,128.84 270 top
R13  148.26,126.78 270 top
R14  106.32,25.65 0 top
R15  106.38,23.7 180 top
R16  152.04,28.04 90 top
R17  114.6,103.84 0 top
R18  123,134.95 180 top
R19  126.03,134.92 180 top
R20  133.13,124.03 270 top
R21  136.55,124.03 90 top
R22  117.22,123.19 270 top
R23  133.05,129.03 90 top
R24  136.18,129.06 270 top
R26  137.64,129.06 90 top
RESET  162.86,47.26 180 bottom
S1  84.99,2.67 0 bottom
SV1  24.97,108.78 0 bottom
U1  66.34,108.33 0 top
U3  124.6,125.9 0 top
U$1  147.17,148.44 0 bottom
U$2  7.21,7.77 0 top
U$3  162.36,162.36 0 top

### Tracks (layer width: path | path; a pad name or v marks a point on that pad's centre or on a via)
!RST  (via drill 0.5 pad 0.41)
  Top 0.305: JP2.2 v148.81,7.5 JP4.2
  Bottom 0.406: v148.81,7.5 158.96,7.5 160.3,8.84 160.3,43.27 160.33,43.27 159.56,44.03 RESET.B RESET.B'
+3V3  (via drill 0.38)
  Top 0.305: Q1.1 94.3,25.61 R1.1 94.3,30.95 94.41,31.06 | v65.3,28.5 65.3,37.41 65.25,37.46 | 150.23,10.04 150.42,10.04 arc45 150.64,10.13 150.64,23.92 arc-45 150.74,24.14 151.61,25.02 151.61,26.76 arc45 R16.1 | J66.1 A1.AREF | U1.VSS2 66.02,112.45 66.12,112.45 | U1.VSS1 66.67,112.45 66.52,112.45
  Top 0.406: A1.3.3V 65.25,37.46 65.05,37.46 63.7,38.81 63.7,97.92 61.67,99.95 C8.2 61.65,109.45 61.65,111.05 63.04,112.45 66.12,112.45 66.52,112.45 103.3,112.45 105.97,115.11 105.97,120.19 L1.2 | 145.21,10.04 145.62,10.04 | R6.1 v87.55,26.75 | v87.55,30.73 87.88,31.06 91.75,31.06
  Top 0.61: JP2.3 145.21,10.04 | 143.95,5.03 JP2.1 JP4.1 148.84,4.98 150.29,4.98 150.72,5.41 arc45 150.8,5.59 150.8,9.58 150.41,9.96 arc45 150.23,10.04 JP4.3 JP2.3 | JP2.3 141.81,10.04 134.39,2.62 113.11,2.62 102.06,13.66 102.06,27.53 98.53,31.06 94.41,31.06 91.75,31.06 91.36,31.06 84.99,37.44 82.51,37.44 J65.4 82.03,37.48 80.85,38.66 80.85,39.8 78.89,41.76 73.25,41.76 71.73,40.23 71.73,38.46 70.71,37.44 69.19,37.44 A1.3.3V
  Bottom 0.305: A1.AREF 62.58,25.78 v65.3,28.5
  Bottom 0.406: v87.55,26.75 v87.55,30.73
+5V  (via drill 0.38)
  Top 0.305: 91.16,33.25 v91.21,33.3 | v90.35,22.58 90.19,22.58 89.86,22.91 89.86,23.92 R2.1
  Top 0.406: Q4.2 137.54,44.76 140.87,41.43
  Top 0.61: 69.37,40.21 A1.5V | 69.72,40.26 69.42,40.26 | 82.47,40.11 J65.5 82.51,40.06 | 91.21,33.5 v91.21,33.3 | 91.16,33.25 91.16,33.53 | JP1.1 126.08,4.93
  Top 0.813: 69.42,40.26 A1.5V
  Top 1.016: 69.72,40.26 72.59,43.13 79.45,43.13 82.47,40.11 | 82.51,40.06 84.66,40.06 91.21,33.5 | 91.16,33.53 92.33,32.36 99.01,32.36 103.28,28.09 103.28,14.55 112.88,4.95 JP1.1 | 126.08,4.93 JP3.1
  Top 1.27: JP1.1 133.2,4.95 140.87,12.62 140.87,41.43 146.58,47.14 147,47.14 | 147,47.14 R3.1 | R7.1 147,60.72 147,47.14
  Bottom 0.305: v91.21,33.3 91.21,23.44 v90.35,22.58
A0
  Top 0.305: JP1.12 121.32,32.89 JP3.12
A7
  Bottom 0.305: JP3.5 121.32,15.11 JP1.5
D0  (via drill 0.38)
  Top 0.305: C4.2 92.71,29.01 R1.2 v92.77,27.71 92.77,25.54 Q1.2 | JP4.12 JP2.12
  Bottom 0.305: v92.77,27.71 95.81,27.71 100.94,32.84 118.01,32.84 119.81,34.65 128.75,34.65 130.5,32.89 JP2.12
D1
  Top 0.305: JP4.11 JP2.11
D4
  Top 0.305: JP4.8 JP2.8
D5
  Top 0.305: JP2.7 JP4.7
D6
  Top 0.305: JP2.6 JP4.6
D7
  Top 0.305: JP2.5 JP4.5
DIN  (via drill 0.38)
  Top 0.305: C4.1 89.66,25.65 R2.2 90.23,25.46 92.28,23.42 Q1.3 | J67.6 8.31,60.33 11.71,63.73 17.7,63.73 20.91,60.53 A1.D2
  Top 0.406: A1.D2 20.94,60.35 22.76,60.35 23.72,61.31 SV1.2 | Q1.3 100.51,23.42 101.07,22.86 101.07,13.34 112.65,1.75 156.29,1.75 | 156.29,1.75 161.65,7.11 | 156.29,16.97 J1.2 156.33,17.04 159.38,17.04 161.62,14.81 161.62,7.04 156.34,1.75 156.29,1.75 | C4.1 89.56,28.91 86.08,28.91 81.97,24.79 35.28,24.79 26.31,33.76 v26.31,54.94
  Bottom 0.406: v26.31,54.94 20.93,60.32 A1.D2 | SV1.P$2 23.7,108.8 SV1.2
GND  (via drill 0.38, 0.5 pad 0.41, 0.6)
  Top 0.305: U1.COM2 65.37,104.71 v65.35,104.7 66.02,105.36 U1.COM3 | U1.COM4 66.67,104.59 v66.47,104.39 | U1.COM1 63.16,108.01 v63.14,108.03 | J65.7 82.46,45.08 A1.GND2 | J65.6 80.78,44.25 70.81,44.25 69.17,42.6 A1.GND | J66.2 A1.GND3 | R19.1 C5.1 | Q3.2 115.34,109.98 C18.1 115.34,108.43 R10.1 | C15.1 140.21,128.73 140.21,128.71 C12.2
  Top 0.406: C11.1 C10.1 C9.1 v74.55,106.4 | BUTTON.P$3 BUTTON.P$2 | C8.1 60.15,107.92 v60.2,107.87 | R19.1 128.65,134.93 v128.83,134.75 | U3.11 129.32,125.9 129.69,125.53 129.69,124.82 v129.92,124.59 | 113.83,119.6 J43.4 | R5.2 v119.28,44.98 | R10.1 113.78,106.87 112.14,106.87 111.57,106.3 111.57,101.47 113.5,99.54 J35.4 | C15.1 139.12,131.7 139.19,131.78 | R12.1 108.72,129.6 108.31,129.18 108.31,127.14 C19.- 106.34,127.09 v105.92,127.51
  Top 0.61: J39.4 33.6,99.69 29.21,99.69 28.72,100.19 SV1.4 | 93.45,119.78 J44.4 | C3.1 126.52,80.52 C2.- | R15.2 105.61,21.01 106.86,19.76 113.46,19.76 J3.4 | C16.1 134.57,131.27 135.08,131.78 139.19,131.78 141.83,131.78 144.68,128.93 v145.29,128.93
  Top 0.813: J2.4 132.39,19.51 130.38,17.5 130.38,12.37 v130.35,12.34
  Bottom 0.305: v65.35,104.7 65.35,104.47 | v66.47,104.39 66.24,104.17 | v63.14,108.03 62.92,108.03
  Bottom 0.406: v60.2,107.87 60.55,107.87 60.58,107.85 | v74.55,106.4 75.06,106.4 | v128.83,134.75 129.24,134.75 | 139.78,133.25 140.34,133.25 140.41,133.32 | v129.92,124.59 130.18,124.59 130.2,124.61 | v119.28,44.98 118.72,44.98 | v105.92,127.51 105.36,127.51 105.05,127.81
  Bottom 0.61: 134.57,132.69 135.18,132.69 | v145.29,128.93 145.9,128.93 145.95,128.98 146.46,128.98 146.51,129.03
  Bottom 0.813: v130.35,12.34 130.35,12.27 129.95,11.86 | 28.7,108.78 31.43,108.78 | 28.7,108.65 28.7,111.38
  other vias: 108.36,129.18
  pour Bottom (isolate 0.508): 0.64,169.54 169.54,169.54 169.54,0.64 0.64,0.64 0.64,19.05 arc1
MICROPH  (via drill 0.38, 0.5)
  Top 0.305: v67.51,72.29 67.61,72.29 67.61,72.26 71.02,68.86 91.39,68.86 93.02,67.23 v105.16,67.23 | JP1.11 126.06,30.3 121.32,30.3 JP3.11 121.3,30.5 120.83,30.97 120.83,31 arc45 120.61,31.09 112.39,31.09 109.68,33.81 109.68,56.54 v106.53,59.69 | J67.5 9.6,59.32 9.6,60.5 12.04,62.94 17.4,62.94 19.46,60.88 19.46,58.55 20.22,57.78 A1.D3
  Top 0.406: A1.D3 23.26,57.78 28.93,63.45 58.7,63.45 v58.73,63.5 | v67.51,72.29 67.51,72.34 66.73,73.13 66.73,98.88 71.86,104.01 77.85,104.01 81.84,108 106.55,108 108.69,110.14 R9.1
  Bottom 0.305: v106.53,59.69 106.53,65.86 v105.16,67.23
  Bottom 0.406: v58.73,63.5 v67.51,72.29
MODE
  Top 0.305: BUTTON.P$4 arc-45 154.05,29.97 152.22,29.97 152.04,29.79 R16.2 151.23,28.8 150.39,27.96 arc45 150.32,27.78 150.32,25.78 149.81,25.27 JP4.9 JP2.9
  Top 0.406: BUTTON.P$4 BUTTON.P$1
N$1
  Bottom 0.305: J2.2 140.58,16.97 140.84,16.71 141.15,16.41 141.17,16.38 151.3,16.38 151.33,16.41 arc45 151.51,16.48 151.99,16.97 153.69,16.97 arc45 J1.3 153.72,16.97
N$2
  Top 0.305: J3.2
  Bottom 0.305: J2.3 133.12,16.38 119.31,16.38 arc-45 119.13,16.46 118.62,16.97 116.26,16.97 arc-45 J3.2
N$3
  Bottom 0.305: J3.3 96.25,16.97 J4.2
N$4
  Top 0.305: J6.2 J5.3
N$5
  Top 0.305: J7.2 53.7,16.99 J6.3
N$6
  Top 0.305: J8.2 33.7,16.98 J7.3
N$7
  Bottom 0.305: J5.2 93.69,16.97 J4.3
N$8  (via drill 0.5)
  Top 0.305: J9.3 v143.69,36.98
  Bottom 0.305: 136.27,36.99 J10.2 143.65,37.02 v143.69,36.98
N$9
  Bottom 0.305: J11.2 116.28,37.02 J10.3
N$10
  Bottom 0.305: J12.2 J11.3
N$11
  Bottom 0.305: J14.2 62.84,36.98 63.6,36.22 72.03,36.22 72.79,36.98 J13.3
N$12
  Top 0.406: J15.2 53.7,37.01 J14.3
N$13
  Bottom 0.305: J16.2 18.51,36.95 18.77,37.21 33.53,37.21 J15.3
N$14
  Bottom 0.305: J13.2 76.38,36.88 80.01,36.88 80.64,36.25 86.92,36.25 87.64,36.97 J12.3
N$15  (via drill 0.5)
  Top 0.305: J18.2 v136.3,56.97
  Bottom 0.305: v136.3,56.97 J17.3
N$16
  Bottom 0.305: J19.2 J18.3
N$17
  Bottom 0.305: J20.2 96.29,56.99 J19.3
N$18
  Top 0.305: 73.72,56.95 J21.3
  Bottom 0.305: J22.2 58.57,56.95 63.22,61.59 68.02,61.59 68.05,61.62 70.61,61.62 71.32,60.91 71.32,58.06 72.42,56.97 J21.3
N$19
  Top 0.305: J23.2 36.28,56.95 J22.3
N$20
  Bottom 0.305: J24.2 16.75,56.49 22.71,56.49 25.2,54 27.53,54 30.49,56.96 J23.3
N$21
  Top 0.305: J21.2 76.79,56.46 85.09,56.46 85.6,56.97 J20.3
N$22
  Bottom 0.305: J26.2 136.28,76.99 J25.3
N$23
  Bottom 0.305: J27.2 116.27,76.96 J26.3
N$24
  Top 0.305: J27.3 113.68,77.01 J28.2
  Bottom 0.305: J28.2 96.31,76.99
N$25
  Bottom 0.305: J30.2 J29.3
N$26
  Top 0.305: J30.3 53.71,76.97 J31.2
  Bottom 0.305: J31.2 36.3,77
N$27
  Bottom 0.305: J32.2 16.29,76.97 J31.3
N$28
  Top 0.305: J28.3 93.72,77 J29.2
  Bottom 0.305: J29.2 76.27,77.01
N$29  (via drill 0.5, 0.6)
  Top 0.305: v24.77,22 24.77,27.81 23.67,28.91 23.67,41.55 v23.62,41.6
  Bottom 0.305: J8.3 13.66,16.92 12.24,16.92 11.63,17.53 11.63,22.61 12.06,23.04 23.72,23.04 v24.77,22 | J9.2 156.3,37.01 157.86,37.01 158.34,37.49 158.34,40.28 156.34,42.29 85.72,42.29 84.73,41.3 73.33,41.3 70.81,43.81 67.26,43.81 66.19,42.75 30.3,42.75 29.16,41.6 v23.62,41.6
N$30  (via drill 0.5)
  Top 0.305: J16.3 12.96,36.95 12.12,37.8 v12.12,40.97
  Bottom 0.305: v12.12,40.97 12.12,44.04 13.36,45.29 61.49,45.29 65.61,49.4 154.55,49.34 155.83,49.34 159.83,53.34 159.83,56.43 159.23,57.02 156.32,57.02 J17.2
N$31
  Bottom 0.305: J24.3 13.1,56.95 11.76,58.29 11.76,67.77 13.56,69.57 60.48,69.57 64.92,74.02 68.28,74.02 70.38,71.91 158.17,71.91 160.2,73.94 160.2,76.1 159.26,77.04 156.3,77.04 J25.2
N$32
  Top 0.305: R9.2 110.69,110.13 Q3.1 113.82,110.03 C18.2
N$33
  Bottom 0.305: J34.2 J33.3
N$34
  Bottom 0.305: J35.2 J34.3
N$35
  Bottom 0.305: J36.2 J35.3
N$36
  Bottom 0.305: J38.2 J37.3
N$37
  Bottom 0.305: J39.2 36.32,96.98 J38.3
N$38
  Bottom 0.305: J40.2 16.29,97.03 J39.3
N$39
  Top 0.305: J36.3 93.7,96.98 J37.2
  Bottom 0.305: J37.2 76.28,97
N$40
  Bottom 0.305: J41.3 136.3,116.96 J42.2
N$41
  Bottom 0.305: 133.71,116.96 J42.3 133.72,116.97 130.56,116.97 129.74,116.15 129.74,114.53 128.7,113.49 121.16,113.49 119.84,114.81 119.84,116 118.88,116.96 J43.2
N$42
  Bottom 0.305: J43.3 J44.2
N$43
  Bottom 0.305: J46.2 56.27,116.98 J45.3
N$44
  Top 0.305: J47.2 J46.3
N$45
  Bottom 0.305: J48.2 J47.3
N$46
  Bottom 0.305: J45.2 76.31,116.96 J44.3
N$47
  Top 0.305: J50.2 136.3,136.99 J49.3
N$48
  Top 0.305: J51.2 116.27,136.97 J50.3
N$49
  Top 0.305: J52.2 96.31,136.94 J51.3
N$50
  Top 0.305: J54.2 56.3,137.01 J53.3
N$51
  Top 0.305: J55.2 J54.3
N$52
  Top 0.305: J56.2 16.29,136.97 J55.3
N$53
  Top 0.305: J53.2 76.36,136.97 J52.3
N$54
  Top 0.305: J58.2 J57.3
N$55
  Top 0.305: J59.2 116.3,156.97 J58.3
N$56
  Top 0.305: J60.2 96.27,157 J59.3
N$57
  Top 0.305: J62.2 J61.3
N$58
  Top 0.305: J63.2 36.3,156.97 J62.3
N$59
  Top 0.305: J64.2 16.27,157 J63.3
N$60
  Top 0.305: J61.2 76.31,157.02 J60.3
N$61
  Bottom 0.305: J40.3 12.57,96.98 11.49,98.06 11.49,101.73 13.84,104.08 39.69,104.08 47.19,111.58 87.3,111.58 88.37,112.65 159.61,112.65 160.71,113.74 160.71,115.49 160.76,115.55 159.31,116.99 156.27,116.99 J41.2
N$62
  Bottom 0.305: J48.3 12.96,116.96 12.01,117.91 12.01,129.79 13.66,131.44 158.55,131.44 160.5,133.4 160.5,136.17 159.72,136.96 156.29,136.96 J49.2
N$63
  Bottom 0.305: J56.3 12.36,136.99 11.07,138.28 11.07,146.91 12.14,147.98 158.8,147.98 161.72,150.9 161.72,154.74 159.49,156.97 J57.2
N$64
  Bottom 0.305: J32.3 13.48,77 12.14,78.33 12.14,83.74 13.77,85.37 111.71,85.37 116,89.66 158.09,89.66 160.91,92.48 160.91,95.38 159.23,97.05 156.31,97.05 J33.2
N$65  (via drill 0.5 pad 0.41)
  Top 0.406: R4.1 124.79,44.98 Q4.1 125.02,43.38 v124.99,43.36
  Top 1.27: Q2.2 127.1,51.28 131.25,47.12 132.41,47.12 R3.2 | Q2.2 127.38,61.11 | Q2.2 127.23,61.53 129.09,61.53 132.14,64.57 R7.2
  Bottom 0.406: v124.99,43.36 124.99,44.04 125.04,44.09 125.04,44.73 127.46,47.14 R3.2 134.98,47.14
N$66
  Top 0.305: Q3.3 114.66,112.12 116.36,112.12 117.09,111.38 117.09,110.62 117.55,110.16 R8.1
N$67
  Top 0.406: Q2.1 122.54,48.99 123.32,48.21 R4.2 | R4.2 125.63,46.51 Q4.3 | R4.2 R5.1
N$68
  Top 0.305: C14.2 113.84,105.38 R17.1
N$69  (via drill 0.5)
  Top 0.305: R17.2 115.42,103.78 116.86,103.78 121.74,108.66 v128.7,108.66 | v134.54,108.66 137.34,108.66 139.9,111.23 139.9,124.36 139.11,125.15 C15.2 R26.1
  Bottom 0.305: v128.7,108.66 v134.54,108.66
N$70
  Top 0.305: U3.13 127.6,128.42 130.94,128.42 131.09,128.27 R23.1 | R23.1 133.33,128.55 133.38,128.55 | R23.1 C16.2 134.63,128.27 R24.1 R26.2
N$71
  Top 0.305: R14.2 107.14,25.6 R15.1 117.55,23.7 arc-45 117.77,23.61 117.99,23.39 arc-45 118.08,23.16 118.08,21.31 121.3,18.1 JP3.6 121.32,17.65 JP1.6
N$72
  Top 0.305: M1.IN 162.46,127.54 C6.1 R13.1
N$73
  Top 0.305: A1.100 69.18,29.86 J65.1
N$74
  Top 0.305: A1.IOREF 69.21,32.33 69.62,32.33 71.4,30.56 79.91,30.56 81.75,32.4 J65.2
N$75
  Top 0.305: 64.62,107.34 63.55,107.34
N$76
  Top 0.305: 64.62,108.66 63.65,108.66
N$77
  Top 0.305: 64.59,109.3 63.68,109.3
N$78
  Top 0.305: 68.1,107.37 69.01,107.37
N$79
  Top 0.305: 68.1,108.66 69.09,108.66
N$80
  Top 0.305: 65.35,110.08 65.35,110.77
N$81
  Top 0.305: 67.33,110.08 67.33,110.77
N$82
  Top 0.305: A1.RESET 72.34,31.75 79.05,31.75 82.23,34.94 J65.3
N$83
  Top 0.305: A1.VIN 69.18,47.64 J65.8
N$84
  Top 0.305: A1.A5 69.22,65.34 J68.6
N$85
  Top 0.305: J66.3 9.27,30.86 10.77,29.36 19.41,29.36 A1.D13
N$86
  Top 0.305: J66.4 8,33.22 11.15,30.07 17.58,30.07 A1.D12
N$87
  Top 0.305: J66.5 8,35.92 9.68,34.24 9.68,32.64 11.46,30.86 16.69,30.86 19.43,33.6 19.43,34.46 A1.D11
N$88
  Top 0.305: J66.6 8,38.66 11.46,42.11 17.91,42.11 19.53,40.49 19.53,39.85 A1.D10
N$89
  Top 0.305: J66.7 8.79,41.02 10.67,42.9 18.34,42.9 19.84,41.4 20.52,41.4 A1.D9
N$90
  Top 0.305: J66.8 A1.D8
N$91
  Top 0.305: J67.1 A1.D7
N$92
  Top 0.305: J67.2 A1.D6
N$93
  Top 0.305: J67.3 8.64,52.7 9.88,51.46 18.57,51.46 19.79,52.68 20.89,52.68 A1.D5
N$94
  Top 0.305: A1.D1 19.2,64.57 10.21,64.57 8.51,62.87 J67.7
N$95
  Top 0.305: J67.8 A1.D0
N$96
  Top 0.305: R18.1 123.79,134.92 R19.2 125.27,134.91 C5.2 122.08,133.26 119.2,130.38 119.2,127.97 119.99,127.18 U3.3
N$97  (via drill 0.6 pad 0.41)
  Top 0.305: U3.9 127.64,123.32 127.69,123.37 130.38,123.37 131.29,124.28 v131.65,124.64 131.8,124.79 R20.1 133.25,124.79 | C6.2 149.54,124.99 v146.41,124.99
  Bottom 0.305: v146.41,124.99 132,124.99 v131.65,124.64
N$98
  Top 0.305: 134.76,123.27 C13.1 R20.2 131.39,123.27 130.23,122.1 U3.8
N$99
  Top 0.305: 136.32,123.36 R21.1 136.42,123.27 C13.2
N$100
  Top 0.305: R22.1 118.09,123.95 118.67,123.37 U3.6 121.64,123.39 123.17,123.39 125.63,120.93 130.73,120.93 131.52,121.72 136.93,121.72 137.97,122.76 137.97,124.08 137.26,124.79 R21.2
N$101
  Top 0.305: C14.1 R10.2 115.39,106.96 118.85,106.96 120.24,108.36 R8.2 C17.2
N$102  (via drill 0.6)
  Top 0.406: 112.29,124.97 R11.2 | R18.2 122.23,134.58 118.42,130.76 118.42,126.03 118.47,125.98 115.55,125.98 v115.47,125.9 | R13.2 147.74,126.02 147.37,126.39 143.71,126.39 v143.51,126.59 | L1.1 105.87,123.14 106.78,124.05 108.14,124.05 C19.+
  Top 0.61: C12.1 142.12,129.82 143.51,128.42 v143.51,126.59 | U3.4 v115.47,125.9 114.54,124.97 112.29,124.97 | R11.2 112.22,124.92 110.54,124.92 109.73,124.1 109.67,124.17 C19.+
  Bottom 0.61: v143.51,126.59 143.51,126.49 143,125.98 115.55,125.98 v115.47,125.9
N$104  (via drill 0.6 pad 0.41)
  Top 0.305: R23.2 127.6,129.8 U3.14 125.29,129.71 v125.2,129.62 | C7.1 112.32,129.62 v114.91,129.62
  Bottom 0.305: v114.91,129.62 v125.2,129.62
N$106  (via drill 0.5)
  Top 0.305: R22.2 118.29,122.43 118.64,122.07 121.58,122.07 U3.7 121.6,120.46 v121.61,120.45 | C17.1 118.72,112.52 121.39,115.19 v121.61,115.19
  Bottom 0.305: v121.61,120.45 v121.61,115.19
REF
  Top 0.305: U3.1 121.57,129.74 120.12,129.74 119.84,129.46 119.84,128.78 120.17,128.44 U3.2 121.62,128.42 123.57,128.42 124.13,127.86 124.13,127.15 | 124.13,127.15 124.13,124.63 | 127.58,124.61 U3.10 124.13,124.63 | U3.5 124.13,124.63 | 124.13,127.15 127.6,127.15 U3.12 135.87,127.18 136.14,127.46 136.14,128.26 R24.2
RX
  Bottom 0.305: JP3.4 121.32,12.57 JP1.4
SOUND  (via drill 0.38)
  Top 0.305: 69.17,52.4 A1.A0 69.68,52.7 70.54,51.84 80.77,51.84 81.57,52.64 J68.1 83.38,52.64 84.2,51.82 106.43,51.82 109.04,49.2 109.04,33.45 112.12,30.38 118.74,30.38 arc-45 118.97,30.29 118.98,30.29 121.3,27.96 | 126.01,27.91 JP1.10 | 126.08,27.79 JP1.10 | v61.92,52.63 62.89,53.59 62.89,97.59 60.73,99.75 60.73,105.89 58.9,107.72 58.9,111.76 60.25,113.11 102.89,113.11 104.17,114.38 104.17,124.13 105.72,125.68 109.88,125.68 110.86,126.66 R12.2 112.25,128.08 C7.2 R11.1 | 121.3,27.96 JP3.10 | 121.3,27.96 121.45,27.81 JP1.10 | R11.1 | 112.3,126.48 R11.1
  Bottom 0.305: v61.92,52.63 69.09,52.63 A1.A0
SWITCH  (via drill 0.38)
  Top 0.305: v128.55,14.63 129.18,15.27 v129.18,19.13 | J67.4 8.09,55.27 9.86,55.27 10.34,54.79 10.34,53.9 11.46,52.78 18.36,52.78 19.51,53.92 19.51,54.69 20.07,55.24 A1.D4 | JP4.10 JP2.10
  Top 0.406: S1.2 v84.99,9.83 84.99,16.26 87.53,18.8 87.53,23.9 | 87.53,23.9 R6.2 | 87.53,23.9 34.7,23.9 25.25,33.35 25.25,52.91 22.92,55.24 A1.D4
  Bottom 0.305: v128.55,14.63 128.02,14.63 127.23,13.84 119.84,13.84 119.3,13.3 arc-45 119.07,13.21 96.72,13.21 93.44,9.92 arc-45 93.21,9.83 v84.99,9.83 | JP2.10 132.72,27.82 129.16,24.26 129.18,24.23 v129.18,19.13
TX
  Top 0.305: JP1.3 126.08,10.01 JP3.3
V+  (via drill 0.6)
  Top 0.305: A1.A4 69.22,62.8 70.97,64.54 80.44,64.54 82.18,62.8 J68.5 | J24.1 16.32,59.46 17.78,59.46 18.85,58.4 18.85,56.67 19.02,56.49 27.08,56.49 31.9,61.32 36.09,61.32 36.27,61.14 J23.1 | J13.1 78.38,39.52 81.48,36.42 81.48,36.09 81.61,36.22 83.41,36.22 | J16.1 16.27,39.47 17.8,39.47 20.07,37.21 22.25,37.21 22.3,37.26 22.3,37.08 22.58,36.8
  Top 0.61: J4.1 96.44,19.7 96.44,21.34 | 96.44,21.34 95.91,21.87 95.86,21.87 | 91.08,21.64 90.19,20.75 90.19,19.41 | 96.44,21.34 96.39,21.34 95.86,21.87 | 95.86,21.87 91.31,21.87 91.08,21.64 | 91.08,21.64 91.06,21.64 90.17,20.75 v90.17,19.33
  Top 0.813: 96.44,21.34 98.73,21.34 | 100.1,11.51 v100.13,11.48 | v110.85,11.86 111.78,11.86 | 21.27,108.78 21.27,105.79 | 21.27,111.76 21.27,108.78 | 18.35,108.78 21.27,108.78
  Top 2.184: 124.64,74.55 124.61,74.55 124.61,63.93 124.74,63.93 124.74,68.53 129.41,68.53 129.41,68.5 119.89,68.5
  Bottom 0.406: J21.1 79.57,62.8 J68.5
  Bottom 0.61: 96.37,119.6 J44.1 | v90.17,19.33 76.43,19.33 J5.1 | J43.1 116.92,119.5
  Bottom 0.813: v100.13,11.48 109.19,11.48 109.58,11.86 v110.85,11.86
  Bottom 1.778: SV1.1 21.22,112.35 SV1.P$1
  other vias: 109.47,11.71 101.17,11.48 89,19.33 84.81,19.33 83.41,19.33
  pour Top (isolate 0.508): 0.64,169.54 169.54,169.54 169.54,0.64 0.64,0.64
XOUT  (via drill 0.38)
  Top 0.305: C11.2 71.28,109.31 U1.X 69.97,109.31 v70,109.27 | 126.06,25.22 JP1.9 121.32,25.27 JP3.9 121.3,25.43 120.11,26.61 120.11,26.64 arc-45 120.02,26.86 120.02,28.32 118.71,29.62 arc45 118.49,29.72 111.63,29.72 108.33,33.02 108.33,48.9 106.15,51.08 67.64,51.08 66.9,51.82 66.9,54.56 67.58,55.24 A1.A1 69.55,55.24 70.66,54.13 70.66,53.49 71.6,52.55 79.83,52.55 J68.2 | v68.07,104.22 64.57,100.71 64.57,60.48 v65.08,59.97
  Bottom 0.305: v70,109.27 69.85,109.27 69.16,108.58 69.16,105.31 v68.07,104.22 | v65.08,59.97 65.08,56.97 66.7,55.35 69.06,55.35 A1.A1
YOUT  (via drill 0.38)
  Top 0.305: U1.Y 71.27,108.01 C10.2 69.95,107.9 v69.93,107.92 | 126.08,22.76 JP1.8 121.32,22.73 JP3.8 121.3,22.89 119.47,24.71 119.47,24.74 arc-45 119.38,24.96 119.38,28.07 118.55,28.89 arc45 118.47,28.93 111.33,28.93 107.67,32.59 107.67,48.41 105.72,50.37 67.41,50.37 66.24,51.54 66.24,56.06 67.97,57.78 A1.A2 70.38,57.78 71.22,58.62 71.22,62.2 72.08,63.07 78.51,63.07 80.97,60.6 80.97,59.21 J68.3 | v69.09,104.14 65.33,100.38 65.33,61.19 v65.91,60.6
  Bottom 0.305: v69.93,107.92 69.93,104.98 v69.09,104.14 | A1.A2 66.62,57.78 65.91,58.5 v65.91,60.6
ZOUT
  Top 0.305: C9.2 71.37,105.28 71.07,104.98 | 71.07,104.98 67.59,104.98 67.33,105.23 67.33,106.56 U1.Z | A1.A3 67.92,60.32 | 126.03,20.12 JP1.7 121.32,20.19 JP3.7 121.3,20.37 118.81,22.86 arc-45 118.72,23.08 118.72,27.56 118.13,28.15 arc45 117.9,28.25 110.97,28.25 107.04,32.18 107.04,48.18 105.41,49.81 67.06,49.81 65.51,51.36 65.51,58.59 67.24,60.32 67.41,60.32 | 67.41,60.32 A1.A3 | 71.07,104.98 71.09,104.98 71.37,105.26 71.37,105.13 65.94,99.69 65.94,61.79 67.41,60.32 | J68.4 78.99,63.73 71.65,63.73 70.61,62.69 70.61,61.65 69.29,60.32 A1.A3

### Text on the board
bPlace: 0 | 0 | A5 | A5 | 1 | 1 | A4 | A4 | 2 | 2 | A3 | A3 | #3 | #3 | A2 | A2 | 4 | 4 | A1 | A1 | #5 | #5 | A0 | A0 | #6 | #6 | 7 | 7 | VIN | VIN | GND | GND | 8 | 8 | GND | GND | #9 | #9 | 5V | 5V | #10 | #10 | 3V3 | 3V3 | #11 | #11 | RST | RST | 12 | 12 | A0 | D0 | 13 | 13 | A1 | D1 | GND | GND | A2 | D2 | AREF | AREF | A3 | D3 | A4 | D4 | A5 | D5 | A6 | D6 | A7 | D7 | RX | GND | TX | 3V3 | GND | RST | VIN | 3V3
Measures: Unit: mm
tDocu: Mike Location